# EasyEDA Pro project USB拓展坞.eprj

# Schematic Schematic1
Board Name: Board1; Create Date: 2025-04-18; Page Name: P1; Project Name: USB拓展坞; Schematic Name: Schematic1; Update Date: 2025-04-21; Company: 嘉立创EDA; Page Size: A4; Version: V1.0
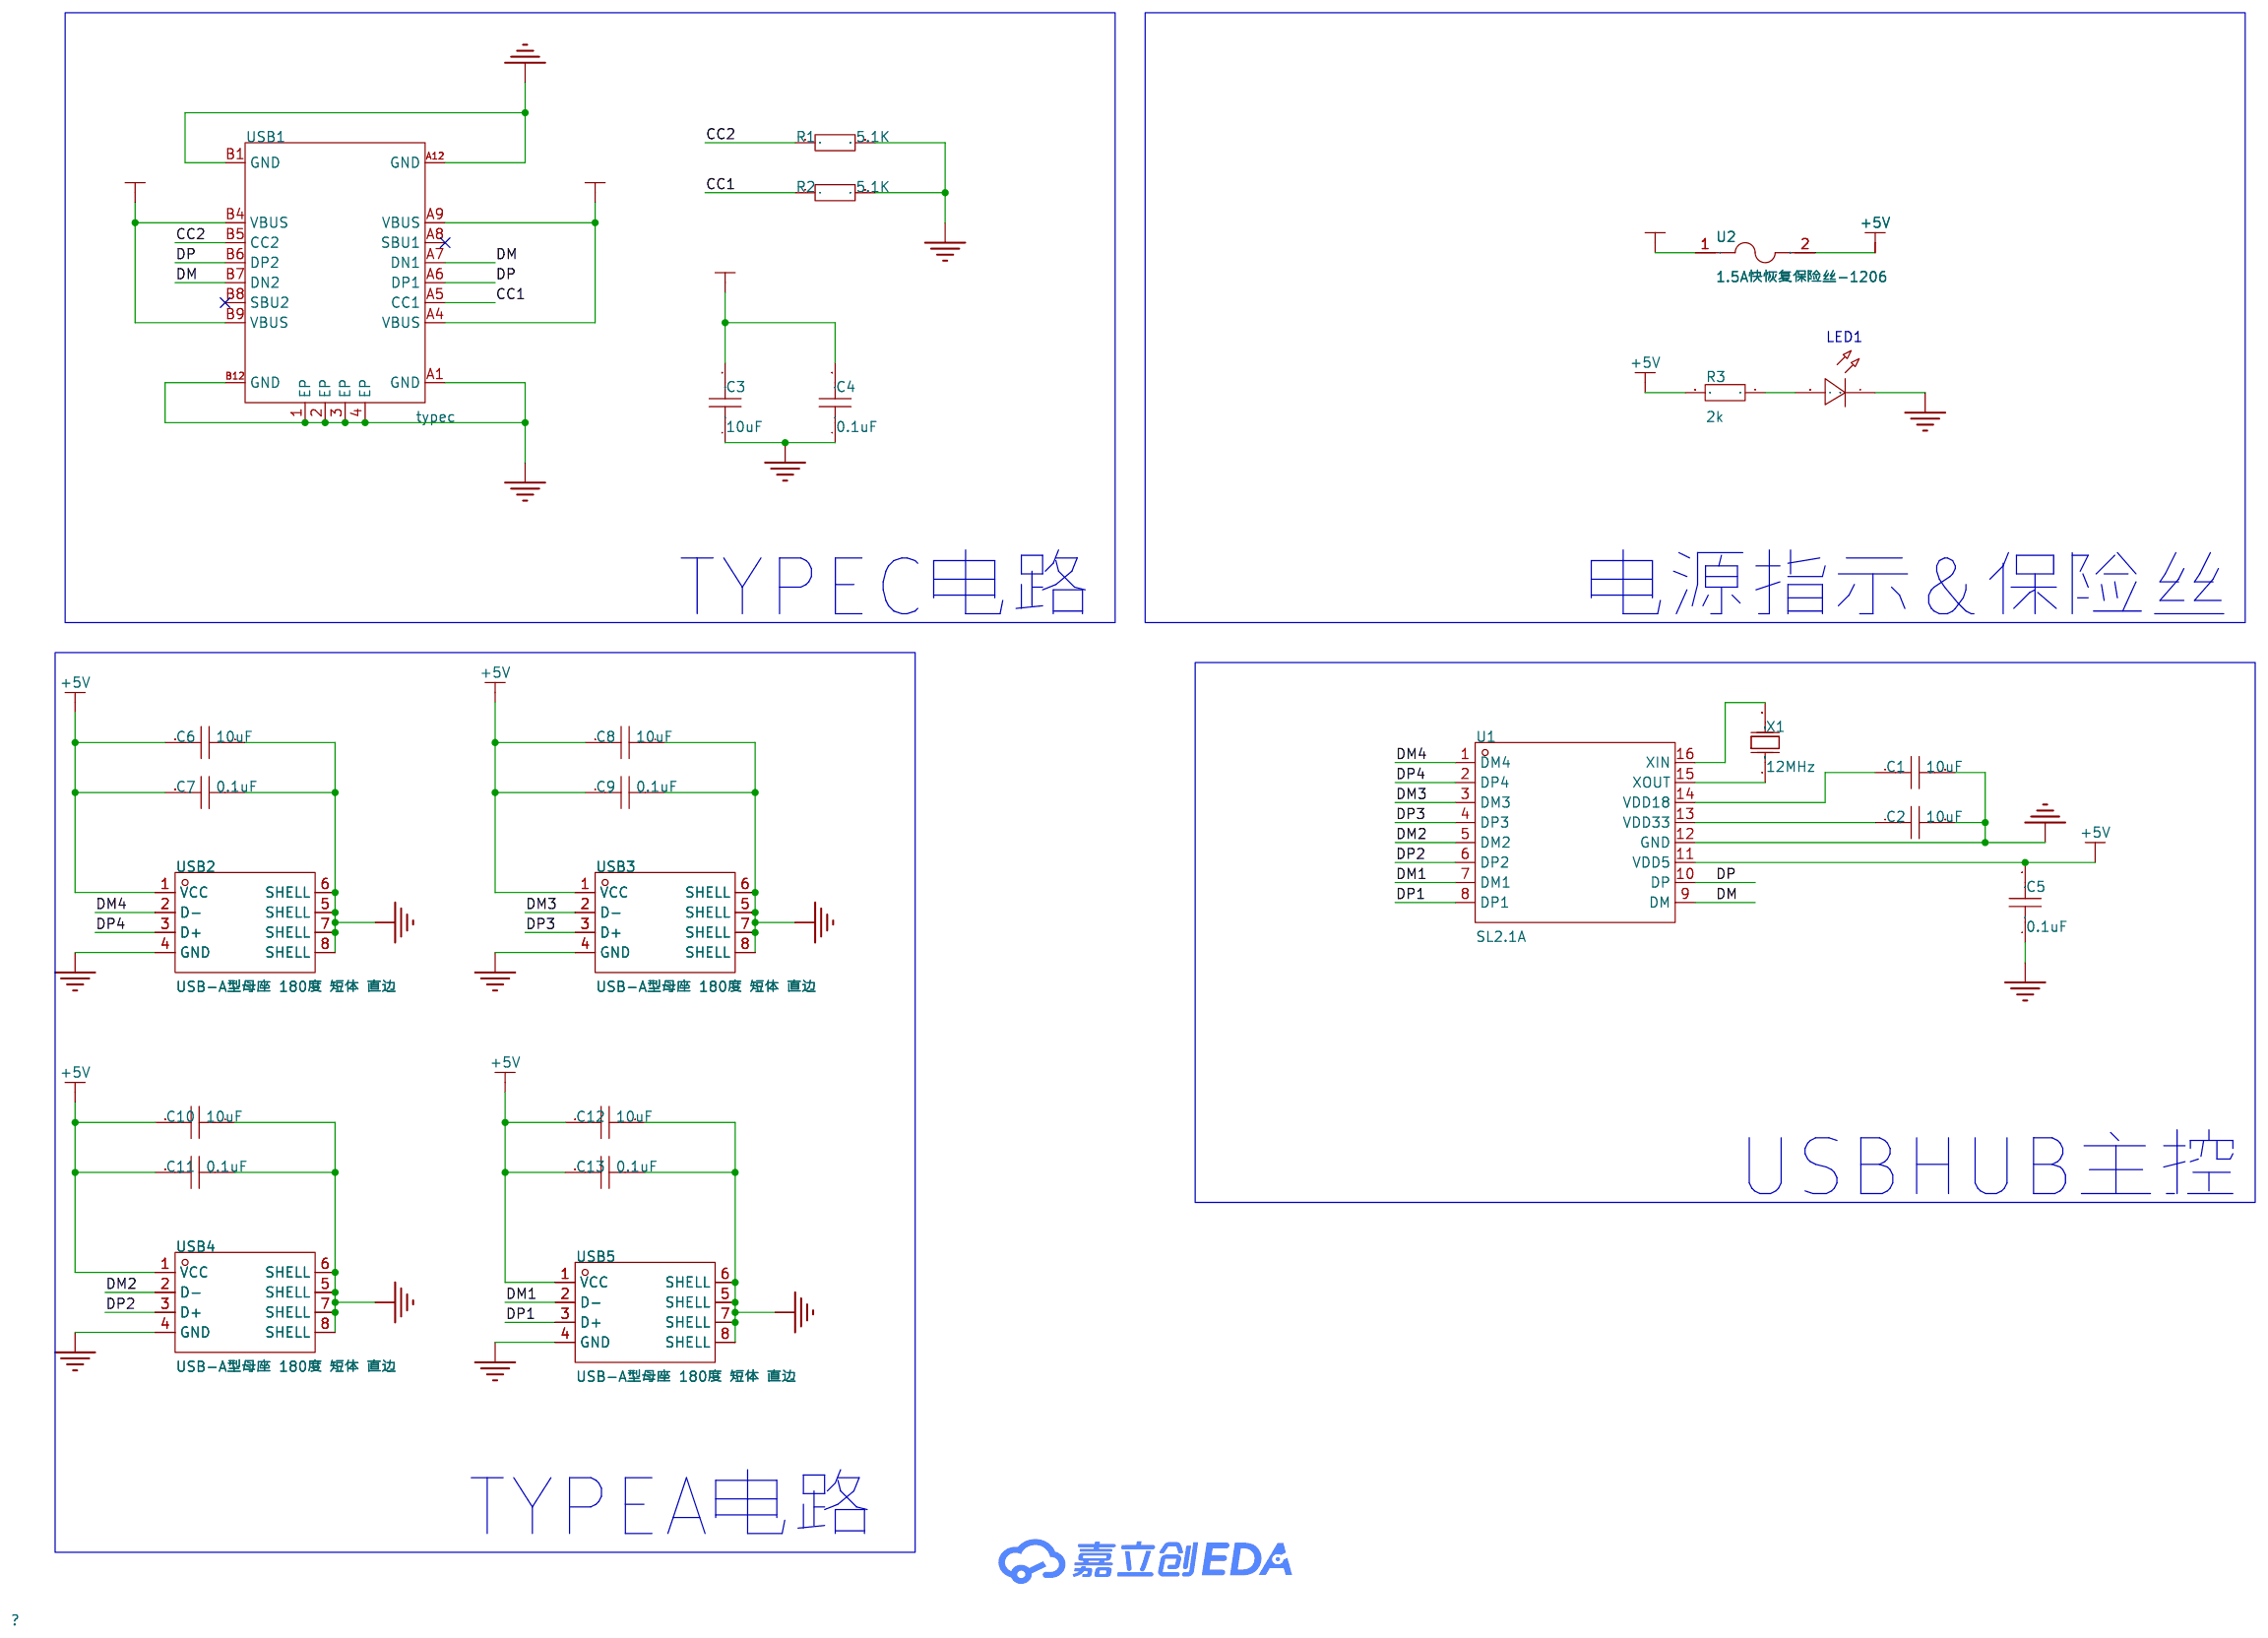
[diagram p0: schematic sheet]

## Parts
C1  10uF  [C0805]
C2  10uF  [C0805]
C3  10uF  [C0805]
C4  0.1uF  [C0805]
C5  0.1uF  [C0805]
C6  10uF  [C0805]
C7  0.1uF  [C0805]
C8  10uF  [C0805]
C9  0.1uF  [C0805]
C10  10uF  [C0805]
C11  0.1uF  [C0805]
C12  10uF  [C0805]
C13  0.1uF  [C0805]
LED1  -  [LED_0805]
R1  5.1K  [R0805]
R2  5.1K  [R0805]
R3  2k  [R0805]
U1  SL2.1A  [SOP-16_L10.0-W3.9-P1.27-LS6.0-BL]
U2  1.5A快恢复保险丝-1206  [F1206]
USB1  typec  [USB-C-SMD_KH-TYPE-C-16P]
USB2  USB-A型母座 180度 短体 直边  [USB-A-SMD_WT_C9900004571]
USB3  USB-A型母座 180度 短体 直边  [USB-A-SMD_WT_C9900004571]
USB4  USB-A型母座 180度 短体 直边  [USB-A-SMD_WT_C9900004571]
USB5  USB-A型母座 180度 短体 直边  [USB-A-SMD_WT_C9900004571]
X1  12MHz  [HC-49US_L11.0-W4.6-P4.88]

## Library data of the parts
C1-C13 = CAP_0805: Supplier Footprint: 0805
LED1 = LED_0805-G: Supplier Footprint: 0805
R1-R3 = Res_0805: Supplier Footprint: 0805
U1 = SL2.1A: LCSC Part Name: USB2.0高速4端口HUB控制器; Supplier Part: C192893; Manufacturer: CoreChips(和芯润德); Supplier Footprint: SOP-16; JLCPCB Part Class: 扩展库; Datasheet: https://atta.szlcsc.com/upload/public/pdf/source/20180522/C192893_624110D24898D57AAC785E3DF98EA862.pdf; Supplier: LCSC
U2 = 1.5A快恢复保险丝-1206: Supplier Part: C9900012139; JLCPCB Part Class: 扩展库; Supplier: LCSC
USB1 = typec: Supplier Part: C9900016956; Supplier Footprint: typec 12p; JLCPCB Part Class: 扩展库; Supplier: LCSC
USB2-USB5 = USB-A型母座 180度 短体 直边: Supplier Part: C9900004571; Supplier Footprint: SMD; JLCPCB Part Class: 扩展库; Supplier: LCSC
X1 = 49SAC12000202060: LCSC Part Name: 12MHz ±20ppm 20pF; Supplier Part: C390746; Manufacturer: JGHC(晶光华); Supplier Footprint: HC-49S; JLCPCB Part Class: 扩展库; Datasheet: https://atta.szlcsc.com/upload/public/pdf/source/20191118/C443544_FEE5A62AFE1FD73D91893808184C550C.pdf; Supplier: LCSC; Crystal Type: 直插晶振; Normal temperature Frequency Tolerance: ±20ppm; External load capacitor: 20pF; Frequency Stability(Full temperature range): ±30ppm; Equivalent Series Resistance (ESR): 60Ω; Operating Temperature: -40℃~+85℃

## Nets
+5V: C5.2 C6.2 C7.2 C8.2 C9.2 C10.2 C11.2 C12.2 C13.2 R3.2 U1.11(VDD5) U2.2 USB2.1(VCC) USB3.1(VCC) USB4.1(VCC) USB5.1(VCC)
GND: C1.2 C2.2 C3.1 C4.1 C5.1 C6.1 C7.1 C8.1 C9.1 C10.1 C11.1 C12.1 C13.1 LED1.1(C) R1.2 R2.2 U1.12(GND) USB1.1(EP) USB1.2(EP) USB1.3(EP) USB1.4(EP) USB1.A1(GND) USB1.A12(GND) USB1.B1(GND) USB1.B12(GND) USB2.4(GND) USB2.5(SHELL) USB2.6(SHELL) USB2.7(SHELL) USB2.8(SHELL) USB3.4(GND) USB3.5(SHELL) USB3.6(SHELL) USB3.7(SHELL) USB3.8(SHELL) USB4.4(GND) USB4.5(SHELL) USB4.6(SHELL) USB4.7(SHELL) USB4.8(SHELL) USB5.4(GND) USB5.5(SHELL) USB5.6(SHELL) USB5.7(SHELL) USB5.8(SHELL)
VCC+5V: C3.2 C4.2 U2.1 USB1.A4(VBUS) USB1.A9(VBUS) USB1.B4(VBUS) USB1.B9(VBUS)
CC1: R2.1 USB1.A5(CC1)
CC2: R1.1 USB1.B5(CC2)
DM: U1.9(DM) USB1.A7(DN1) USB1.B7(DN2)
DM1: U1.7(DM1) USB5.2(D-)
DM2: U1.5(DM2) USB4.2(D-)
DM3: U1.3(DM3) USB3.2(D-)
DM4: U1.1(DM4) USB2.2(D-)
DP: U1.10(DP) USB1.A6(DP1) USB1.B6(DP2)
DP1: U1.8(DP1) USB5.3(D+)
DP2: U1.6(DP2) USB4.3(D+)
DP3: U1.4(DP3) USB3.3(D+)
DP4: U1.2(DP4) USB2.3(D+)
$1N939: C2.1 U1.13(VDD33)
$1N949: C1.1 U1.14(VDD18)
$1N1052: U1.15(XOUT) X1.1(OSC1)
$1N1056: U1.16(XIN) X1.2(OSC2)
$1N2648: LED1.2(A) R3.1

Not connected (* = marked no-connect by the designer): USB1 A8(SBU1)* B8(SBU2)*

## Notes on the sheet
- TYPEC电路
- 电源指示&保险丝
- USBHUB主控
- TYPEA电路

# Board PCB1
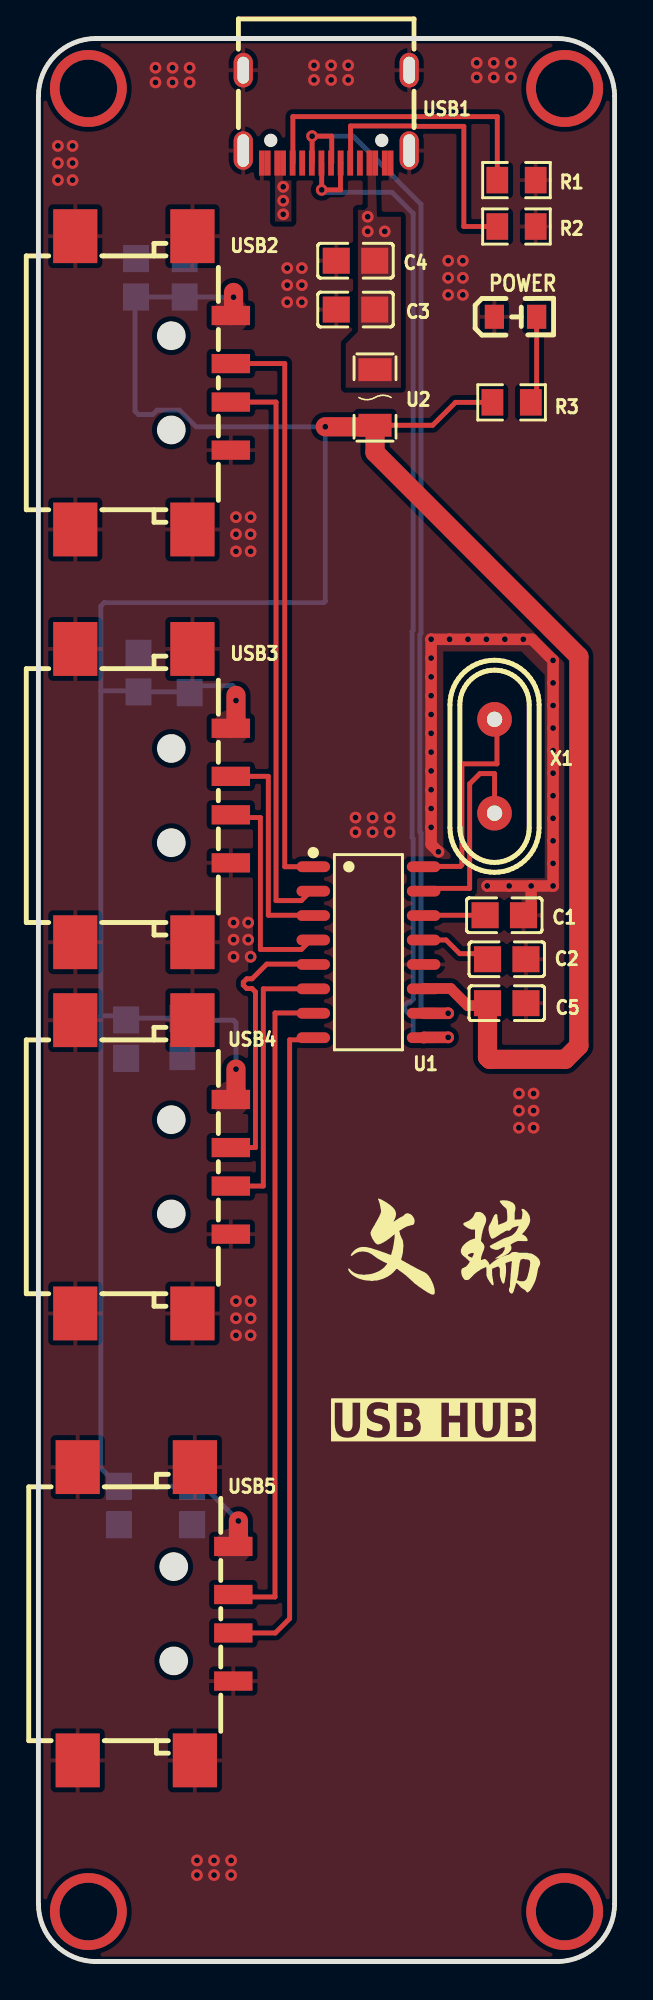
[diagram p1: board, top side]
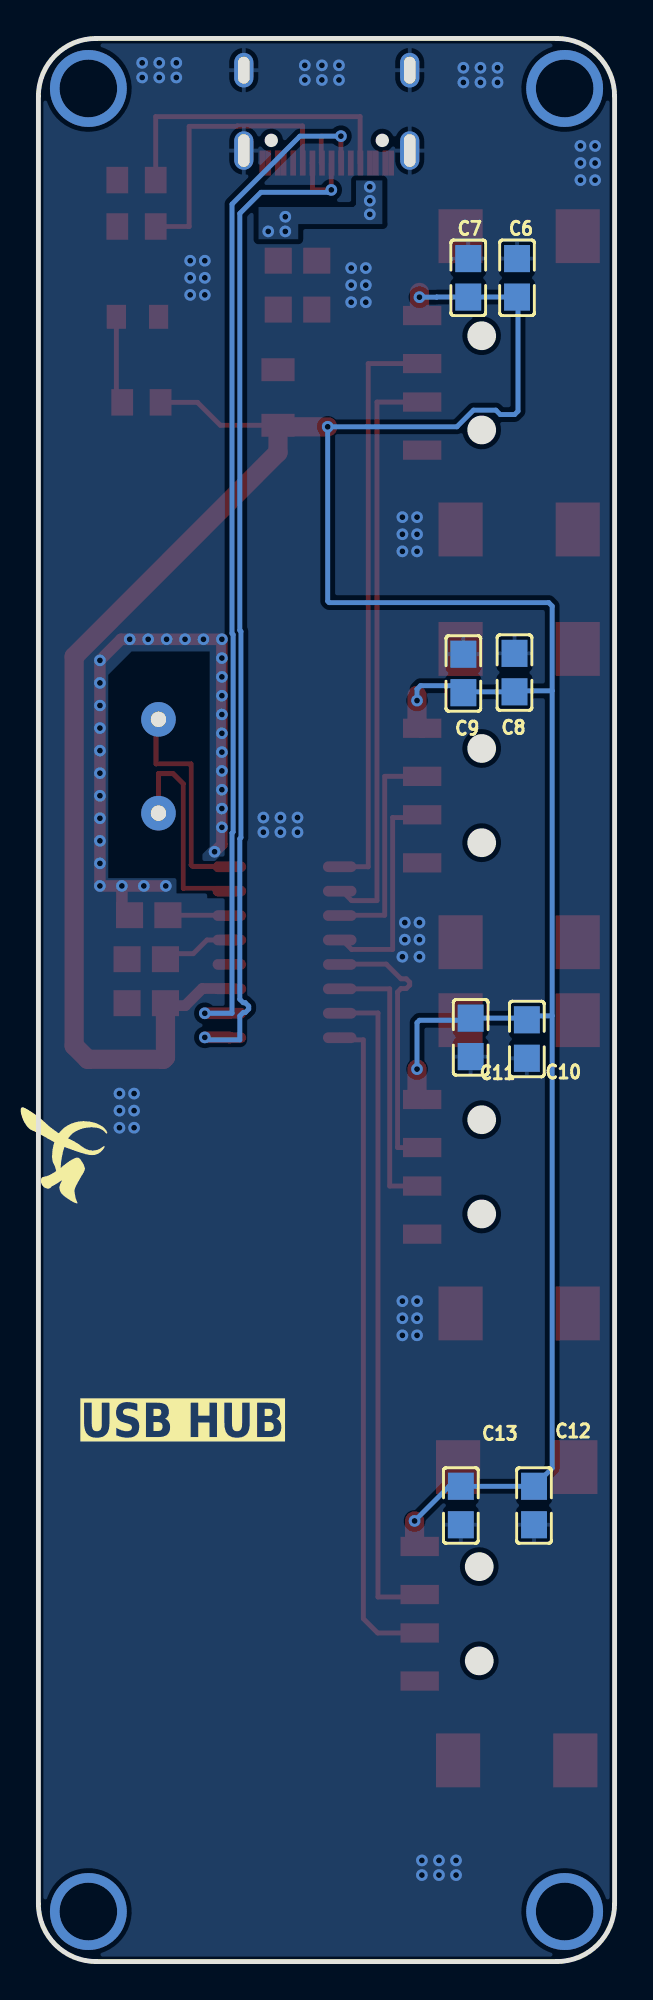
[diagram p2: board, bottom side, seen from below]

Outline 30 x 100 mm; copper layers: Top Layer, Bottom Layer. Coordinates in mm from the lower left corner of the outline.
Outline path: 0,97 0,3 arc(0.88,0.88) 3,0 27,0 arc(29.12,0.88) 30,3 30,97 arc(29.12,99.12) 27,100 3,100 arc(0.88,99.12) 0,97
Stack: Top Layer 0.035mm / Dielectric1 1.51mm FR4 er 4.5 / Bottom Layer 0.035mm

## Design rules (mm)
net DM4: DP4
net DP4: DP4
net DM3: DP3
net DP3: DP3
net DM2: DP2
net DP2: DP2
net DM1: DP1
net DP1: DP1
net $1N1056: DP6
net $1N1052: DP6
net DP: DP5
net DM: DP5
template: 自定义配置
spacing copperThickness1oz (default): track to track 0.102, other pairs 0.152 to 0.3
spacing copperThickness2oz: track to track 0.203, other pairs 0.152 to 0.3
track width copperThickness1oz (default): min 0.127, default 0.254, max 2.54
track width copperThickness2oz: min 0.203, default 0.254, max 2.54
differential pair differentialPair (default): width min 0.127, default 0.254, max 2.54; gap min 0.152, default 0.152
via viaSize (default): diameter min 0.5, default 0.61, max 10; hole min 0.3, default 0.305, max 6.299

## Placement (name value [footprint] x y rotation side)
C1  10uF  [C0805]  24.26 54.41 0 top
C2  10uF  [C0805]  24.38 52.12 0 top
C3  10uF  [C0805]  16.51 85.9 0 top
C4  0.1uF  [C0805]  16.51 88.44 0 top
C5  0.1uF  [C0805]  24.38 49.83 180 top
C6  10uF  [C0805]  5.08 87.55 270 bottom
C7  0.1uF  [C0805]  7.62 87.55 270 bottom
C8  10uF  [C0805]  5.21 67.03 270 bottom
C9  0.1uF  [C0805]  7.87 66.98 270 bottom
C10  10uF  [C0805]  4.57 47.97 90 bottom
C11  0.1uF  [C0805]  7.49 48.06 90 bottom
C12  10uF  [C0805]  4.19 23.71 90 bottom
C13  0.1uF  [C0805]  8 23.71 90 bottom
LED1  -  [LED_0805]  24.89 85.52 0 top
R1  5.1K  [R0805]  24.89 92.63 0 top
R2  5.1K  [R0805]  24.89 90.22 0 top
R3  2k  [R0805]  24.64 81.08 180 top
U1  SL2.1A  [SOP-16_L10.0-W3.9-P1.27-LS6.0-BL]  17.18 52.48 270 top
U2  1.5A快恢复保险丝-1206  [F1206]  17.53 81.33 270 top
USB1  typec  [USB-C-SMD_KH-TYPE-C-16P]  14.99 95.94 180 top
USB2  USB-A型母座 180度 短体 直边  [USB-A-SMD_WT_C9900004571]  5.97 82.09 270 top
USB3  USB-A型母座 180度 短体 直边  [USB-A-SMD_WT_C9900004571]  5.97 60.63 270 top
USB4  USB-A型母座 180度 短体 直边  [USB-A-SMD_WT_C9900004571]  5.97 41.33 270 top
USB5  USB-A型母座 180度 短体 直边  [USB-A-SMD_WT_C9900004571]  6.1 18.09 270 top
X1  12MHz  [HC-49US_L11.0-W4.6-P4.88]  23.75 62.15 90 top

## Footprints (pads in the part's own frame, mm; a bottom-side part is the same pattern mirrored in y, then rotated)
C0805
  rect 1.41x1.35 smd: 1(-1,0) 2(1,0)
F1206
  rect 1.19x1.728 smd: 1(-1.445,0) 2(1.445,0)
HC-49US_L11.0-W4.6-P4.88
  round 1.8 hole 0.8: 1(-2.44,0) 2(2.44,0)
LED_0805
  rect 1x1.25 smd: 1(-1.15,0.005) 2(1.05,0.005)
R0805
  rect 1.133x1.377 smd: 1(-1,0) 2(1,0)
SOP-16_L10.0-W3.9-P1.27-LS6.0-BL
  oval 0.56x1.745 smd: 1(-4.445,-2.873) 2(-3.175,-2.873) 3(-1.905,-2.873) 4(-0.635,-2.873) 5(0.635,-2.873) 6(1.905,-2.873) 7(3.175,-2.873) 8(4.445,-2.873) 9(4.445,2.873) 10(3.175,2.873) 11(1.905,2.873) 12(0.635,2.873) 13(-0.635,2.873) 14(-1.905,2.873) 15(-3.175,2.873) 16(-4.445,2.873)
USB-A-SMD_WT_C9900004571
  rect 1x2 smd: 1(-3.5,4.05) 2(-1,4.05) 3(1,4.05) 4(3.5,4.05)
  rect 2.8x2.3 smd: 5(-7.625,2.05) 6(-7.625,-4.05) 7(7.625,-4.05) 8(7.625,2.05)
USB-C-SMD_KH-TYPE-C-16P
  oval 1x2 hole 0.6x1.7: 1(-4.32,1.765) 2(4.32,1.765)
  oval 1x1.8 hole 0.6x1.4: 3(-4.32,-2.415) 4(4.32,-2.415)
  rect 0.3x1.3 smd: A1(-3.35,2.415) A4(-2.55,2.415) A5(-1.25,2.415) A6(-0.25,2.415) A7(0.25,2.415) A8(1.25,2.415) A9(2.55,2.415) A12(3.35,2.415) B1(3.05,2.415) B4(2.25,2.415) B5(1.75,2.415) B6(0.75,2.415) B7(-0.75,2.415) B8(-1.75,2.415) B9(-2.25,2.415) B12(-3.05,2.415)

## Nets
As in the schematic.

Pads without a net: USB1 A8 B8

## Via types
v1: diameter 4, hole 3, Top Layer to Bottom Layer, 4 vias
v2: diameter 0.61, hole 0.305, Top Layer to Bottom Layer, 118 vias

## Routing (per net, layer and track width the routed paths; a pad name or vN(x,y) marks a point on that pad's centre or on a via; arc(x,y) is an arc through that point)
+5V: length 176.6
  Top Layer w0.254: U2.2 20.53,79.89 21.72,81.08 R3.2
  Top Layer w0.56: 23.26,49.71 22.35,49.71 21.46,50.6 20.07,50.6 U1.11
  Top Layer w1: 10.16,86.79 10.16,85.73 USB2.1 ; v2(10.41,22.91) 10.41,21.85 USB5.1 ; USB4.1 10.29,45.09 v2(10.29,46.41) ; USB3.1 10.29,64.4 10.29,65.84 ; C5.2 23.38,47.03 23.5,46.91 27.43,46.91 28.14,47.62 28.14,67.86 17.53,78.47 U2.2 17.45,79.81 v2(14.94,79.81)
  Bottom Layer w0.254: 3.25,49.17 3.25,25.66 C12.2 C13.2 8.61,24.71 v2(10.41,22.91) ; 3.25,49.17 4.36,49.17 C10.2 4.66,49.06 C11.2 7.6,48.95 10.16,48.95 10.29,48.82 v2(10.29,46.41) ; 3.25,49.17 3.25,66.08 ; v2(10.29,65.57) 10.29,66.17 10.11,66.34 8.24,66.34 C9.2 7.83,66.03 C8.2 5.16,66.08 3.25,66.08 ; 3.25,66.08 3.25,70.48 3.43,70.66 14.86,70.66 14.94,70.74 v2(14.94,79.81) 8.21,79.81 7.35,80.67 6.18,80.67 5.95,80.44 5.21,80.44 5.03,80.62 5.03,86.5 C6.2 C7.2 9.25,86.55 9.26,86.55 v2(10.16,86.55)
GND: length 34.9
  Top Layer w0.6: v2(25.65,55.93) v2(26.8,55.93) v2(26.8,57.1) v2(26.8,58.28) v2(26.8,59.45) v2(26.8,60.62) v2(26.8,61.8) v2(26.8,62.97) v2(26.8,64.14) v2(26.8,65.31) v2(26.8,66.49) v2(26.8,67.66) 25.7,68.76 v2(25.25,68.76) v2(24.29,68.76) v2(23.33,68.76) v2(22.37,68.76) v2(21.41,68.76) v2(20.45,68.76) v2(20.45,67.78) v2(20.45,66.8) v2(20.45,65.82) v2(20.45,64.85) v2(20.45,63.87) v2(20.45,62.89) v2(20.45,61.91) v2(20.45,60.94) v2(20.45,59.96) v2(20.45,58.98) 20.45,58.09 v2(20.83,57.71) ; v2(25.65,55.93) v2(24.51,55.93) v2(23.37,55.93) ; v2(25.65,55.93) 25.65,54.8 C1.2
  vias: v2(1.02,94.41) v2(1.02,93.52) v2(1.02,92.63) v2(1.78,94.41) v2(1.78,93.52) v2(1.78,92.63) v2(6.1,98.48) v2(6.1,97.71) v2(6.99,98.48) v2(6.99,97.71) v2(7.87,98.48) v2(7.87,97.71) v2(8.25,5.26) v2(8.25,4.5) v2(9.14,5.26) v2(9.14,4.5) v2(10.03,5.26) v2(10.03,4.5) v2(10.16,54.03) v2(10.16,53.14) v2(10.16,52.25) v2(10.29,75.11) v2(10.29,74.22) v2(10.29,73.33) v2(10.29,34.34) v2(10.29,33.45) v2(10.29,32.56) v2(10.92,54.03) v2(10.92,53.14) v2(11.05,75.11) v2(11.05,74.22) v2(11.05,73.33) v2(11.05,52.25) v2(11.05,34.34) v2(11.05,33.45) v2(11.05,32.56) v2(12.95,88.06) v2(12.95,87.17) v2(12.95,86.28) v2(13.72,88.06) v2(13.72,87.17) v2(13.72,86.28) v2(14.35,98.6) v2(14.35,97.84) v2(15.24,98.6) v2(15.24,97.84) v2(16.13,98.6) v2(16.13,97.84) v2(16.51,59.49) v2(16.51,58.72) v2(17.4,59.49) v2(17.4,58.72) v2(18.29,59.49) v2(18.29,58.72) v2(21.34,88.44) v2(21.34,87.55) v2(21.34,86.67) v2(22.1,88.44) v2(22.1,87.55) v2(22.1,86.67) v2(22.82,98.73) v2(22.82,97.97) v2(23.71,98.73) v2(23.71,97.97) v2(24.6,98.73) v2(24.6,97.97) v2(25.02,45.14) v2(25.02,44.25) v2(25.02,43.36) v2(25.78,45.14) v2(25.78,44.25) v2(25.78,43.36)
VCC+5V:
  vias: v2(12.75,92.29) v2(12.75,91.56) v2(12.75,90.86) v2(17.15,90.73) v2(17.15,89.97) v2(18.03,89.97)
(no net):
  vias: v1(2.6,97.4) v1(2.6,2.6) v1(27.4,97.4) v1(27.4,2.6)
CC1: length 14.8
  Top Layer w0.254: 16.25,93.52 16.25,95.45 19.64,95.45 19.66,95.43 22.15,95.43 22.15,90.22 R2.1
CC2: length 16.4
  Top Layer w0.254: R1.1 23.89,95.94 13.25,95.94 13.25,93.52
DM: length 55.7
  Top Layer w0.254: 15.75,93.52 15.73,93.5 15.73,92.13 v2(14.75,92.13) 14.75,93.52
  Top Layer w0.6: v2(21.34,48.06) 20.07,48.06 U1.9
  Bottom Layer w0.254: v2(14.75,92.13) 14.88,92 18.41,92 19.51,90.9 19.51,69.23 19.46,69.17 19.46,58.44 19.51,58.38 19.51,50.04 19.33,49.86 19.23,49.86 19.05,49.68 19.05,49.53 19.23,49.35 19.33,49.35 19.51,49.17 19.51,47.93 21.21,47.93 v2(21.34,48.06)
DM1: length 34.7
  Top Layer w0.254: USB5.2 10.27,18.96 12.32,18.96 12.32,49.33 14.29,49.33 U1.7 14.31,49.44
DM2: length 14.3
  Top Layer w0.254: USB4.2 11.3,42.33 11.3,50.41 11.12,50.59 10.85,50.59 10.67,50.77 10.67,50.92 10.85,51.1 11.12,51.1 11.89,51.87 14.29,51.87 U1.5
DM3: length 11.4
  Top Layer w0.254: USB3.2 11.97,61.63 11.97,54.41 14.17,54.41 14.18,54.39
DM4: length 30.3
  Top Layer w0.254: USB2.2 12.83,83.09 12.83,56.93 14.18,56.93
DP: length 55.8
  Top Layer w0.254: 14.25,93.52 v2(14.25,94.92) 15.27,94.92 15.27,93.54 15.25,93.52
  Top Layer w0.6: U1.10 v2(21.34,49.31)
  Bottom Layer w0.254: v2(21.34,49.31) 19.92,49.31 19.92,58.68 19.86,58.74 19.86,69 19.92,69.06 19.92,91.38 16.38,94.92 v2(14.25,94.92)
DP1: length 34.8
  Top Layer w0.254: USB5.3 12.34,17.09 13.08,17.83 13.08,47.93 14.31,47.93 14.31,48.17
DP2: length 14.4
  Top Layer w0.254: 14.18,50.58 11.71,50.58 11.71,40.33 USB4.3
DP3: length 11.3
  Top Layer w0.254: 14.18,53.12 13.69,52.63 11.56,52.63 11.56,59.49 10.16,59.49 USB3.3
DP4: length 30.3
  Top Layer w0.254: USB2.3 12.37,81.09 12.37,55.17 13.69,55.17 14.18,55.66
$1N939: length 3.4
  Top Layer w0.254: 23,52.12 22.72,52.41 21.94,52.41 21.23,53.12 U1.13
$1N949: length 3
  Top Layer w0.254: 23,54.41 20.07,54.41 U1.14
$1N1052: length 11.5
  Top Layer w0.254: U1.15 20.2,55.8 22.45,55.8 22.45,61.24 22.99,61.77 23.75,61.77 X1.1
$1N1056: length 11.5
  Top Layer w0.254: U1.16 20.07,56.95 21.97,56.95 22.05,57.02 22.05,62.28 23.88,62.28 23.88,64.47 X1.2
$1N2648: length 4.4
  Top Layer w0.254: 25.64,81.2 25.94,81.51 LED1.2

## Copper pours and planes (outline as drawn; the poured copper is in the pictures)
GND on Top Layer: -9.14,106.73 34.93,106.73 34.93,-5.79 -9.14,-5.79
GND on Bottom Layer: -7.37,105.97 36.45,105.97 36.45,-4.52 -7.37,-4.52
VCC+5V on Top Layer: 16,94.03 18.87,94.03 18.87,81.84 16,81.84
VCC+5V on Top Layer: 12.32,94.03 13.17,94.03 13.17,90.47 12.32,90.47
VCC+5V on Bottom Layer: 12.08,92.62 18.54,92.62 18.54,89.56 12.08,89.56

## Text on the board
Bottom Silkscreen Layer: USB HUB
Top Silkscreen Layer: POWER | USB HUB
